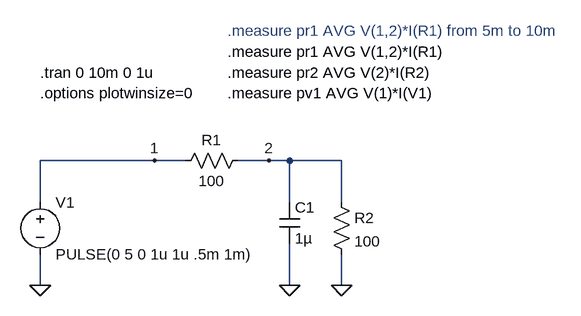
[diagram p0: schematic meas_avg_power.asc]
meas_avg_power.asc, the LTspice schematic file:
Version 4
SHEET 1 880 680
WIRE -400 176 -400 112
WIRE -400 304 -400 256
WIRE -224 112 -400 112
WIRE -176 112 -224 112
WIRE -48 112 -96 112
WIRE -16 112 -48 112
WIRE -16 176 -16 112
WIRE -16 304 -16 240
WIRE 64 112 -16 112
WIRE 64 176 64 112
WIRE 64 304 64 256
FLAG 64 304 0
FLAG -16 304 0
FLAG -400 304 0
FLAG -224 112 1
FLAG -48 112 2
SYMBOL voltage -400 160 R0
WINDOW 123 0 0 Left 0
WINDOW 39 0 0 Left 0
SYMATTR InstName V1
SYMATTR Value PULSE(0 5 0 1u 1u .5m 1m)
SYMBOL res -192 128 R270
WINDOW 0 32 56 VTop 0
WINDOW 3 0 56 VBottom 0
SYMATTR InstName R1
SYMATTR Value 100
SYMBOL cap -32 176 R0
SYMATTR InstName C1
SYMATTR Value 1µ
SYMBOL res 48 160 R0
SYMATTR InstName R2
SYMATTR Value 100
TEXT -400 -24 Left 0 !.tran 0 10m 0 1u
TEXT -400 8 Left 0 !.options plotwinsize=0
TEXT -112 -56 Left 0 !.measure pr1 AVG V(1,2)*I(R1)
TEXT -112 -24 Left 0 !.measure pr2 AVG V(2)*I(R2)
TEXT -112 8 Left 0 !.measure pv1 AVG V(1)*I(V1)
TEXT -112 -88 Left 0 ;.measure pr1 AVG V(1,2)*I(R1) from 5m to 10m

The netlist it stands for:
* meas_avg_power.asc
V1 1 0 PULSE(0 5 0 1u 1u .5m 1m)
R1 1 2 100
C1 2 0 1µ
R2 2 0 100
.tran 0 10m 0 1u
.options plotwinsize=0
.measure pr1 AVG V(1,2)*I(R1)
.measure pr2 AVG V(2)*I(R2)
.measure pv1 AVG V(1)*I(V1)
* .measure pr1 AVG V(1,2)*I(R1) from 5m to 10m
.backanno
.end